# Altium schematic sheet [7] WiFi.SchDoc
size A4; DocumentNumber: 4; SheetNumber: 4; SheetTotal: 10
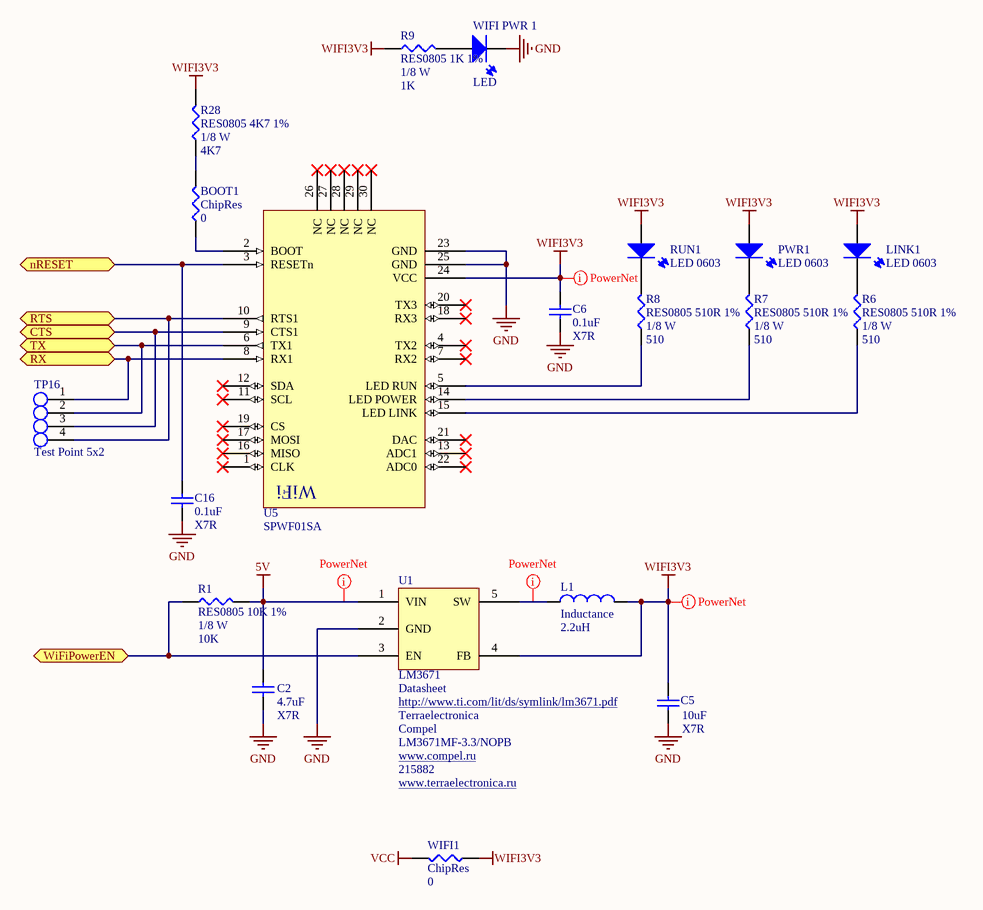
[diagram p0: [7] WiFi.SchDoc]

## Parts
BOOT1  ChipRes  value 0  [RES0805]
C2  value 4.7uF  Type: X7R  [CAP1210]  (hidden comment: ChipCap 4.7u X7R)
C5  value 10uF  Type: X7R  [CAP1210]  (hidden comment: ChipCap 10u X7R)
C6  value 0.1uF  Type: X7R  [CAP0805]  (hidden comment: CAP0805 0.1uF X7R)
C16  value 0.1uF  Type: X7R  [CAP0805]  (hidden comment: CAP0805 0.1uF X7R)
L1  Inductance  value 2.2uH  [CDRH2D14]
LINK1  LED 0603  [LED 0603]
PWR1  LED 0603  [LED 0603]
R1  RES0805 10K 1%  value 10K  Rating: 1/8 W  [RES0805]
R6  RES0805 510R 1%  value 510  Rating: 1/8 W  [RES0805]
R7  RES0805 510R 1%  value 510  Rating: 1/8 W  [RES0805]
R8  RES0805 510R 1%  value 510  Rating: 1/8 W  [RES0805]
R9  RES0805 1K 1%  value 1K  Rating: 1/8 W  [RES0805]
R28  RES0805 4K7 1%  value 4K7  Rating: 1/8 W  [RES0805]
RUN1  LED 0603  [LED 0603]
TP16  Test Point 5x2  [PG-1.5-13.5-4P-2.54PH]
U1  LM3671  ComponentLink1Description: Datasheet  Supplier 1: Terraelectronica  Supplier 2: Compel  Supplier Part Number 2: LM3671MF-3.3/NOPB  Supplier Part Number 1: 215882  [SOT23-5]
U5  SPWF01SA  [SPWF01SA]
WIFI1  ChipRes  value 0  [RES0805]
WIFI_PWR_1  LED  [PLCC-2]

## Ports
CTS, nRESET, RTS, RX, TX, WiFiPowerEN

## Nets
5V: C2.2 R1.2 U1.1(VIN)
GND: C2.1 C5.1 C6.2 C16.2 U1.2(GND) U5.23(GND) U5.25(GND) WIFI_PWR_1.1
VCC: WIFI1.2
WIFI3V3: C5.2 C6.1 L1.1 LINK1.2 PWR1.2 R9.1 R28.2 RUN1.2 U1.4(FB) U5.24(VCC) WIFI1.1
CTS: TP16.3 U5.9(CTS1) ; port CTS
nRESET: C16.1 U5.3(RESETn) ; port nRESET
RTS: TP16.4 U5.10(RTS1) ; port RTS
RX: TP16.1 U5.8(RX1) ; port RX
TX: TP16.2 U5.6(TX1) ; port TX
WiFiPowerEN: R1.1 U1.3(EN) ; port WiFiPowerEN
NetBOOT1_1: BOOT1.1 R28.1
NetBOOT1_2: BOOT1.2 U5.2(BOOT)
NetL1_2: L1.2 U1.5(SW)
NetLINK1_1: LINK1.1 R6.2
NetPWR1_1: PWR1.1 R7.2
NetR6_1: R6.1 U5.15(LED_LINK)
NetR7_1: R7.1 U5.14(LED_POWER)
NetR8_1: R8.1 U5.5(LED_RUN)
NetR8_2: R8.2 RUN1.1
NetR9_2: R9.2 WIFI_PWR_1.2

Not connected (* = marked no-connect by the designer): U5 1(CLK)* 4(TX2)* 7(RX2)* 11(SCL)* 12(SDA)* 13(ADC1)* 16(MISO)* 17(MOSI)* 18(RX3)* 19(CS)* 20(TX3)* 21(DAC)* 22(ADC0)* 26(NC)* 27(NC)* 28(NC)* 29(NC)* 30(NC)*

## Layout directives
net class Undefined: 5V, NetL1_2, WIFI3V3

## Notes on the sheet
- (in symbol SPWF01) WiFi

## Library data of the parts
BOOT1 WIFI1 = ChipRes: Chip resistor
C2 = ChipCap 4.7uF X7R: Surface-mount ceramic multilayer capacitor; Manufacturer: YAGEO; Voltage: 25V; Tolerance: 10%; ComponentLink1Description: Datasheet; ComponentLink1URL: http://www.deaha.com/pdf/YAGEO-CC_series.pdf
C5 = ChipCap 10uF X7R: Surface-mount ceramic multilayer capacitor; Manufacturer: YAGEO; Voltage: 25V; Tolerance: 10%; ComponentLink1Description: Datasheet; ComponentLink1URL: http://www.deaha.com/pdf/YAGEO-CC_series.pdf
C6 C16 = CAP0805 0.1uF X7R: Surface-mount ceramic multilayer capacitor; Manufacturer: YAGEO; Manufacturer Part Number: CC0805JRX7R9BB104; Voltage: 50V; Tolerance: 5%; ComponentLink1Description: Datasheet; ComponentLink1URL: http://www.deaha.com/pdf/YAGEO-CC_series.pdf
L1 = ChipInductance
LINK1 PWR1 RUN1 WIFI_PWR_1 = LED0603
R1 = RES0805 10K 1%: Think Film Chip resistor; Manufacturer Part Number: RC0805FR-0710KL; Temperature Coefficient: 100ppm/K; Tolerance: 1%; Type: ThickFilm
R6-R8 = RES0805 510R 1%: Think Film Chip resistor; Manufacturer Part Number: RC0805FR-07510RL; Temperature Coefficient: 100ppm/K; Tolerance: 1%; Type: ThickFilm
R9 = RES0805 1K 1%: Think Film Chip resistor; Manufacturer Part Number: RC0805FR-071KL; Temperature Coefficient: 100ppm/K; Tolerance: 1%; Type: ThickFilm
R28 = RES0805 4K7 1%: Think Film Chip resistor; Manufacturer Part Number: RC0805FR-074K7L; Temperature Coefficient: 100ppm/K; Tolerance: 1%; Type: ThickFilm
TP16 = PG-1.5-13.5-4P-2.54PH
U1 = LM3671MF: 600-mA Step-Down DC-DC Converter; ComponentLink1URL: http://www.ti.com/lit/ds/symlink/lm3671.pdf; Supplier URL 2: www.compel.ru; Supplier URL 1: www.terraelectronica.ru
U5 = SPWF01: Serial-to-Wi-Fi b/g/n intelligent module